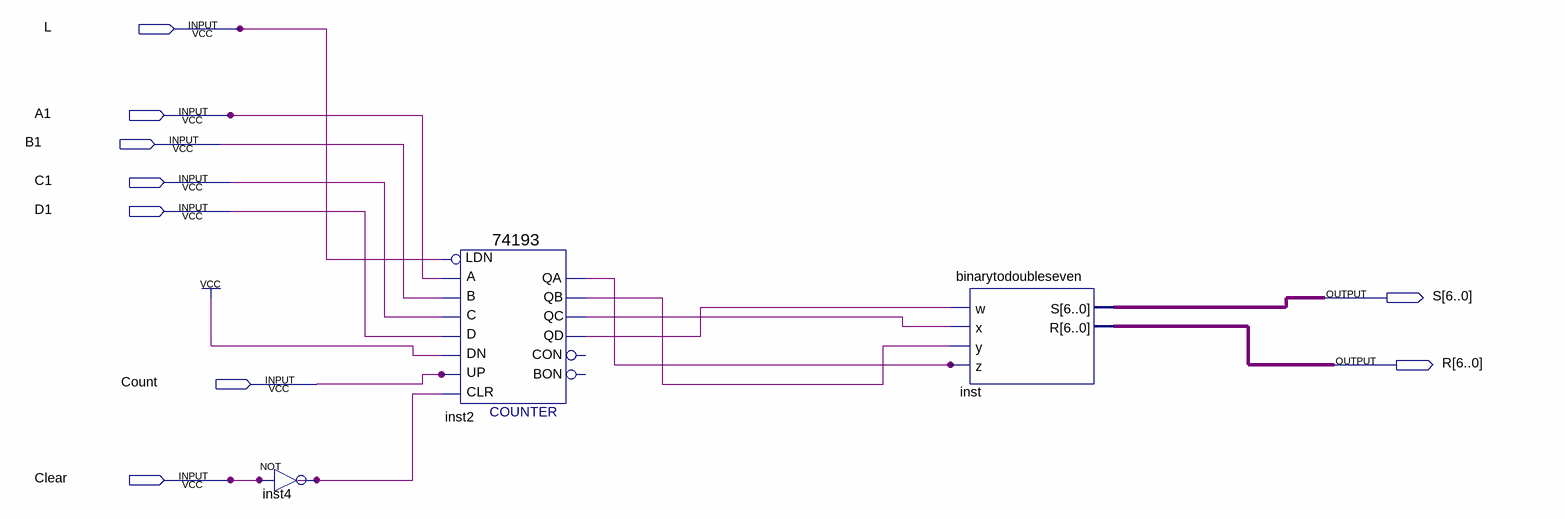
[diagram p0: schematic sheet]
// Quartus schematic doublesevensegblock.bdf as structural Verilog: 3 symbols, 9 pins
module doublesevensegblock (
  input  L,
  input  A1,
  input  B1,
  input  C1,
  input  D1,
  input  Count,
  input  Clear,
  output [6:0] S,
  output [6:0] R
);

  wire inst2_qa, inst2_qb, inst2_qc, inst2_qd, inst4_out;

  not inst4 (inst4_out, Clear);
  \74193  inst2 (
    .D(D1), .C(C1), .B(B1), .A(A1), .CLR(inst4_out), .UP(Count), .DN(1'b1), .LDN(L), .QB(inst2_qb),
    .QA(inst2_qa), .QD(inst2_qd), .QC(inst2_qc));  // open: CON, BON
  binarytodoubleseven inst (.w(inst2_qd), .x(inst2_qc), .y(inst2_qb), .z(inst2_qa), .S(S), .R(R));
endmodule
